# EAGLE design tomu-eagle-easy (EAGLE 8.7.1)
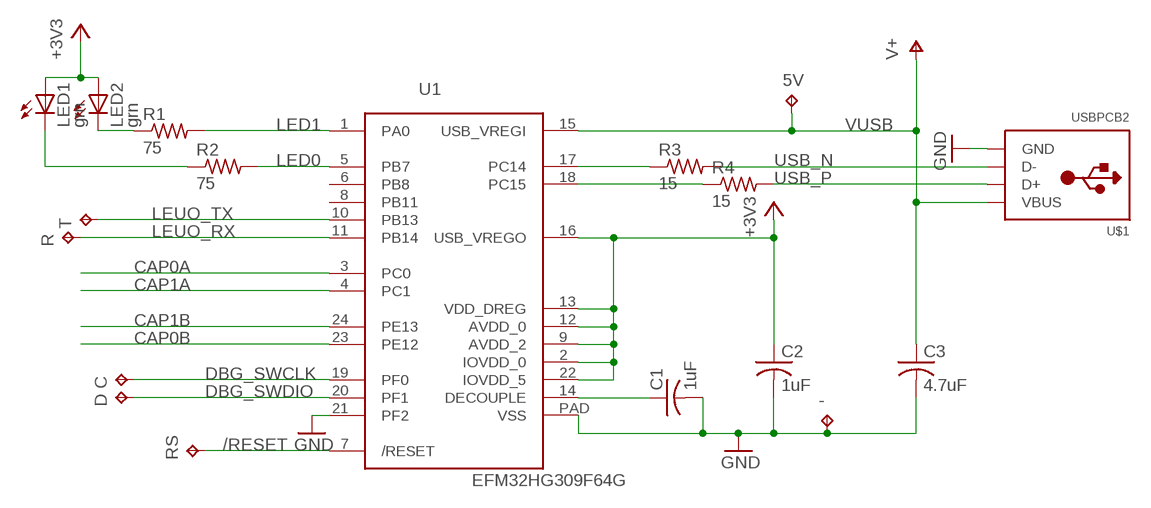
[diagram p0: schematic, sheet 1]

## Parts
5V  TPTP10R  [TP10R]
-  TPTP10SQ  [TP10SQ]
C  TPTP10R  [TP10R]
C1  1uF  C-USC0402K  [C0402K]
C2  1uF  C-USC0402  [C0402]
C3  4.7uF  C-USC0402  [C0402]
D  TPTP10R  [TP10R]
LED1  grn  LEDCHIP-LED0603  [CHIP-LED0603]
LED2  grn  LEDCHIP-LED0603  [CHIP-LED0603]
R  TPTP10R  [TP10R]
R1  75  R-US_R0402  [R0402]
R2  75  R-US_R0402  [R0402]
R3  15  R-US_R0402  [R0402]
R4  15  R-US_R0402  [R0402]
RS  TPTP10R  [TP10R]
T  TPTP10R  [TP10R]
U1  EFM32HG309F64G  [QFN24PAD]
U$1  USBPCB2  [USB-A-PCB-2]

## Nets
+3V3: C2.1 LED1.A LED2.A U1.2(IOVDD_0) U1.9(AVDD_2) U1.12(AVDD_0) U1.13(VDD_DREG) U1.16(USB_VREGO) U1.22(IOVDD_5)
/RESET: RS.TP U1.7(/RESET)
CAP0A: U1.3(PC0)
CAP0B: U1.23(PE12)
CAP1A: U1.4(PC1)
CAP1B: U1.24(PE13)
DBG_SWCLK: C.TP U1.19(PF0)
DBG_SWDIO: D.TP U1.20(PF1)
DECOUPLE: C1.1 U1.14(DECOUPLE)
GND: -.TP C1.2 C2.2 C3.2 U1.21(PF2) U1.PAD(VSS) U$1.GND
LED0: R2.2 U1.5(PB7)
LED1: R1.2 U1.1(PA0)
LEUO_RX: R.TP U1.11(PB14)
LEUO_TX: T.TP U1.10(PB13)
N$4: LED1.C R2.1
N$5: LED2.C R1.1
RUSB_N: R3.1 U1.17(PC14)
RUSB_P: R4.1 U1.18(PC15)
USB_N: R3.2 U$1.USB_M(D-)
USB_P: R4.2 U$1.USB_P(D+)
VUSB: 5V.TP C3.1 U1.15(USB_VREGI) U$1.5V(VBUS) ; supply symbol labelled V+
Unconnected: U1.6(PB8) U1.8(PB11)

## Library data of the parts
5V - C D R RS T = testpad:TP: Test pad
C1-C3 = adafruit:C-US: CAPACITOR, American symbol
LED1 LED2 = adafruit:LED: LED OSRAM: - CHIPLED LG R971, LG N971, LY N971, LG Q971, LY Q971, LO R971, LY R971 LH N974, LH R974 LS Q976, LO Q976, LY Q976 LO Q996 - Hyper CHIPLED LW Q18S LB Q993, LB Q99A, LB R99A - SideLED LS A670, LO A670, LY A670, LG A670, LP A670 LB A673, LV A673, LT A673, LW A673 LH A674 LY A675 LS A676, LA A676, LO A676, LY A676, LW A676 LS A679, LY A679, LG A679 - Hyper Micro SIDELED® LS Y876, LA Y876, LO Y876, LY Y876 LT Y87S - SmartLED LW L88C, LW L88S LB L89C, LB L89S, LG L890 LS L89K, LO L89K, LY L89K LS L896, LA L896, LO L896, LY L896 - TOPLED LS T670, LO T670, LY T670, LG T670, LP T670 LSG T670, LSP T670, LSY T670, LOP T670, LYG T670 LG T671, LOG T671, LSG T671 LB T673, LV T673, LT T673, LW T673 LH T674 LS T676, LA T676, LO T676, LY T676, LB T676, LH T676, LSB T676, LW T676 LB T67C, LV T67C, LT T67C, LS T67K, LO T67K, LY T67K, LW E67C LS E67B, LA E67B, LO E67B, LY E67B, LB E67C, LV E67C, LT E67C LW T67C LS T679, LY T679, LG T679 LS T770, LO T770, LY T770, LG T770, LP T770 LB T773, LV T773, LT T773, LW T773 LH T774 LS E675, LA E675, LY E675, LS T675 LS T776, LA T776, LO T776, LY T776, LB T776 LHGB T686 LT T68C, LB T68C - Hyper Mini TOPLED® LB M676 - Mini TOPLED Santana® LG M470 LS M47K, LO M47K, LY M47K Source: http://www.osram.convergy.de/
R1-R4 = adafruit:R-US_: RESISTOR, American symbol
U1 = todstuff:EFM32HG309F64G
U$1 = todstuff:USB

## Board
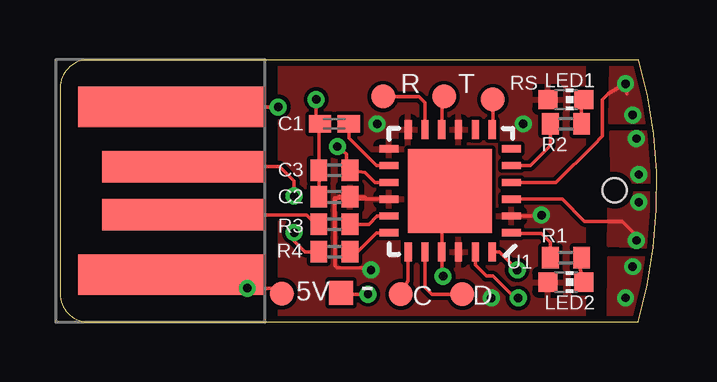
[diagram p1: board, top side]
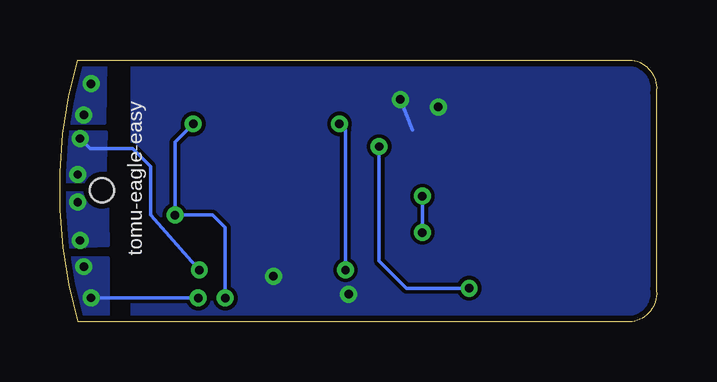
[diagram p2: board, bottom side, seen from below]

Size 24.88 x 10.92 mm. Coordinates in mm from the lower left corner, seen from the top.
Outline: 0.01,9.54 0.01,1.38 arc90 1.01,0 24.12,0 arc32 24.14,10.92 1.01,10.92 arc90 0.01,9.54
Copper layers (1*16): Top 0.0356mm / dielectric 1.5011mm / Bottom 0.0356mm
Design rules "LaenPCBOrderTodTent *": minimum track width 6mil, minimum drill 13mil, track to track 6mil, track to pad 6mil, pad to pad 6mil, via to via 6mil, smd to smd 6mil, copper to edge 10mil, drill to drill 6mil, minimum pad ring 7mil, minimum via ring 7mil, stop-mask expansion 3mil, vias tented up to drill 20mil, thermal gap 10mil
Holes 1 mm at 23.13,5.49

### Footprints (pad centres in the part's own frame; a part is rotated, then mirrored left to right if it is on the bottom)
TP10R = smd 1 x 1: TP 0,0
TP10SQ = smd 1 x 1: TP 0,0
C0402K = smd 0.925 x 0.74: 1 -0.6,0; 2 0.6,0
C0402 = smd 0.7 x 0.9: 1 -0.65,0; 2 0.65,0
CHIP-LED0603 = smd 0.8 x 0.8: A 0,-0.75; C 0,0.75
R0402 = smd 0.7 x 0.9: 1 -0.65,0; 2 0.65,0
QFN24PAD = smd 0.8 x 0.3: 1 -2.55,1.75; 2 -2.55,1.05; 3 -2.55,0.35; 4 -2.55,-0.35; 5 -2.55,-1.05; 6 -2.55,-1.75; 13 2.55,-1.75; 14 2.55,-1.05; 15 2.55,-0.35; 16 2.55,0.35; 17 2.55,1.05; 18 2.55,1.75 | smd 0.3 x 0.8: 7 -1.75,-2.55; 8 -1.05,-2.55; 9 -0.35,-2.55; 10 0.35,-2.55; 11 1.05,-2.55; 12 1.75,-2.55; 19 1.75,2.55; 20 1.05,2.55; 21 0.35,2.55; 22 -0.35,2.55; 23 -1.05,2.55; 24 -1.75,2.55 | smd 3.5 x 3.5: PAD 0,0
USB-A-PCB-2 = smd 7.75 x 1.69: 5V -1.47,-3.5; GND -1.47,3.5 | smd 6.75 x 1.3: USB_M -0.97,-1; USB_P -0.97,1

### Placement (x,y rotation side)
5V  9.26,1.17 180 top
-  11.72,1.2 0 top
C  14.21,1.14 270 top
C1  11.44,8.25 180 top
C2  11.44,5.21 180 top
C3  11.44,6.32 180 top
D  16.78,1.14 270 top
LED1  21.1,9.27 270 top
LED2  21.1,1.65 270 top
R  13.48,9.4 180 top
R1  21.1,2.67 180 top
R2  21.1,8.25 180 top
R3  11.44,4.06 180 top
R4  11.44,2.92 180 top
RS  18.05,9.27 270 top
T  16.02,9.4 180 top
U1  16.27,5.46 180 top
U$1  6.11,5.46 0 top

### Tracks (layer width: path | path; a pad name or v marks a point on that pad's centre or on a via)
+3V3  (via drill 0.35)
  Top 0.152: 12,5.16 C2.1 12.71,5.21 12.81,5.11 U1.16 12.05,5.11 12,5.16 | 12,5.16 11.44,5.17 11.44,3.94 | U1.2 20.05,4.41 v20.08,4.44 | v12.97,2.16 12.89,2.24 11.57,2.24 11.47,2.33 11.47,5.07 11.65,5.25
  Bottom 0.152: v19.32,8.25 20.08,7.49 v20.08,4.44 18.5,4.44 17.98,3.93 v17.98,0.99 | v12.97,2.16 12.97,8 v13.22,8.25
  pour Top: 21.86,0.13 9.16,0.13 9.16,11.56 21.86,11.56
/RESET
  Top 0.152: U1.7 18.05,8.04 RS.TP
CAP0A  (via drill 0.35)
  Top 0.152: U1.3 20.94,5.11 21.86,4.19 23.44,4.19 24.04,3.6 v24.04,3.39
  other vias: 24.14,4.99
  pour Top: 22.87,3.17 24.73,3.09 24.93,5.37 22.9,5.38
  pour Bottom: 22.87,3.17 24.73,3.09 24.93,5.37 22.9,5.38
CAP0B  (via drill 0.35)
  Top 0.152: U1.23 17.32,2.37 17.78,1.91 18.05,1.91 18.97,0.99 v19.11,0.99
  Bottom 0.152: v19.11,0.99 22.97,0.99 v23.58,1
  other vias: 23.88,2.3
  pour Top: 22.87,0.13 22.88,2.69 24.65,2.66 24.19,0.13
  pour Bottom: 22.87,0.13 22.87,2.67 24.65,2.66 24.19,0.13
CAP1A  (via drill 0.35)
  Top 0.152: U1.4 20.68,5.81 22.25,7.38 22.62,7.75 22.62,9.27 22.87,9.53 v23.58,9.92 23.64,9.53
  other vias: 23.88,8.62
  pour Top: 22.92,8.29 24.69,8.3 24.11,10.88 22.98,10.87
  pour Bottom: 23.02,8.29 24.79,8.28 24.11,10.85 22.98,10.87
CAP1B  (via drill 0.35)
  Top 0.152: 18.05,2.88 U1.24 18.31,2.91 v19.06,2.16
  Bottom 0.152: v19.06,2.16 21.1,4.44 21.1,6.48 21.84,7.22 23.62,7.22 v24.04,7.64
  other vias: 24.14,6.14
  pour Top: 23.03,5.81 24.93,5.82 24.6,7.91 22.96,7.91
  pour Bottom: 23,5.85 24.93,5.82 24.73,7.91 22.96,7.91
DBG_SWCLK
  Top 0.152: C.TP 14.52,1.7 U1.19
DBG_SWDIO
  Top 0.152: D.TP 15.51,1.14 15.22,1.43 U1.20
DECOUPLE
  Top 0.152: U1.14 13.19,6.51 12.04,7.65 C1.1
GND  (via drill 0.35)
  Top 0.152: C2.2 C3.2 10.79,8.27 10.68,8.38 | U$1.GND v9.1,8.96 | C1.2 10.68,8.25 10.68,8.38 | 10.68,8.38 v10.68,9.27 | -.TP 11.57,1.14 v12.84,1.14 | U1.PAD 15.92,5.11 U1.21 15.92,1.95 v15.98,1.89
  Bottom 0.152: v10.68,9.27 10.17,8
  pour Bottom: 21.86,11.05 21.86,-0.64 0.01,-0.64 0.01,11.05
LED0
  Top 0.152: U1.5 19.61,6.51 20.45,7.35 R2.2
LED1
  Top 0.152: U1.1 18.85,3.68 20.08,3.68 20.45,3.32 R1.2
LEUO_RX
  Top 0.152: U1.11 15.22,9.14 14.97,9.4 R.TP
LEUO_TX
  Top 0.152: U1.10 15.92,8.92 T.TP
N$4
  Top 0.152: LED1.C 21.75,9.17 R2.1
N$5
  Top 0.152: R1.1 21.59,2.57 LED2.C
RUSB_N
  Top 0.152: U1.17 13.22,4.41 | 13.22,4.41 13.22,4.39 | 13.22,4.41 12.88,4.06 R3.1
RUSB_P
  Top 0.152: U1.18 13.2,3.71 | 13.2,3.71 | 12.31,2.92 R4.1 12.41,2.92 13.2,3.71
USB_N
  Top 0.152: R3.2 10.69,4.06 10.29,4.46 U$1.USB_M
USB_P  (via drill 0.35)
  Top 0.152: U$1.USB_P 5.16,6.48 9.16,6.48 9.77,5.87 v9.77,5.24 | v9.77,3.72 9.77,3.37 10.21,2.92 10.22,2.92 R4.2
  Bottom 0.152: v9.77,5.24 v9.77,3.72
VUSB  (via drill 0.35)
  Top 0.152: U1.15 13.13,5.81 12.71,6.22 C3.1 11.95,6.31 11.95,6.98 v11.57,7.31 | v7.81,1.4 U$1.5V 5.2,1.4 v7.81,1.4 9.23,1.4 5V.TP
  Bottom 0.152: v11.57,7.31 11.57,2.54 10.43,1.4 v7.81,1.4

### Text on the board
bPlace: tomu-eagle-easy